# Altium schematic sheet ESP32C3_VOICE_LED_ES7243E_Sheet.SchDoc: ESP32C3_VOICE_LED
size A4; Author: Hoozz; Organization: Hoozz Play; DocumentNumber: 2; Revision: 1.0; SheetNumber: 2; SheetTotal: 3
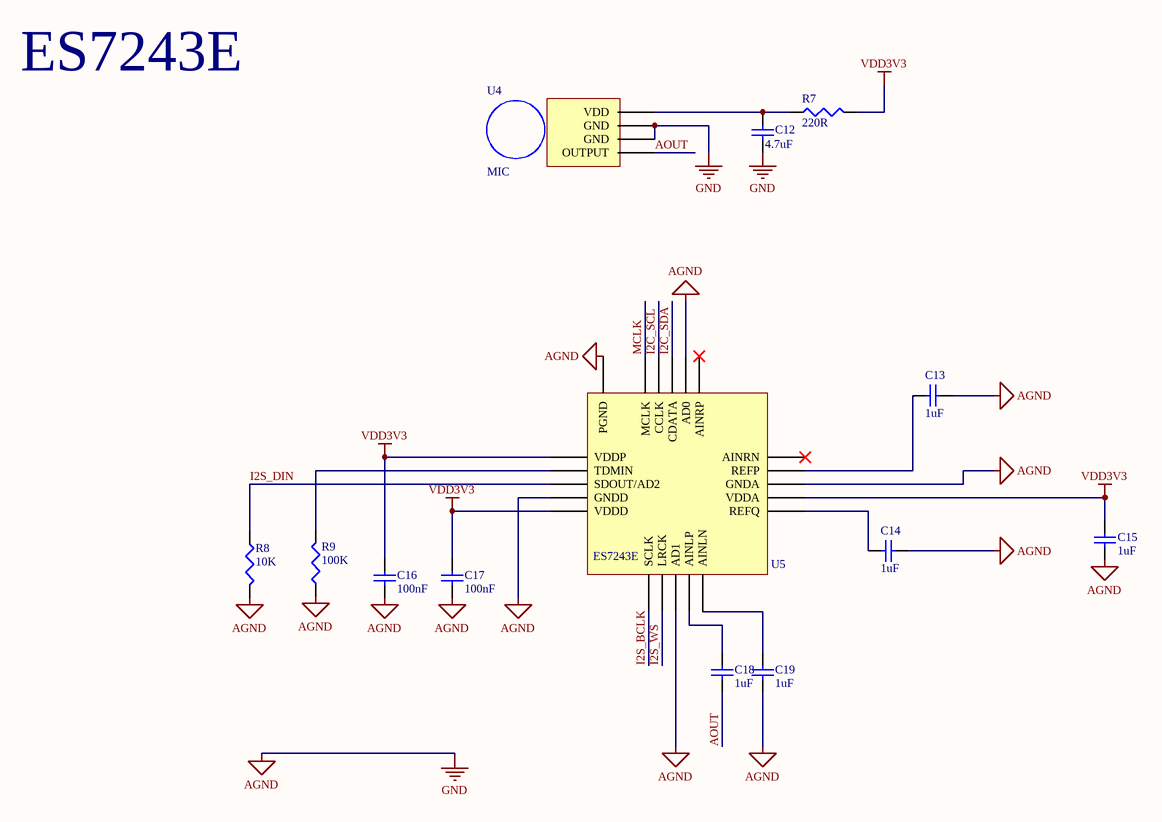
[diagram p0: ESP32C3_VOICE_LED_ES7243E_Sheet.SchDoc]

## Parts
C12  value 4.7uF  [0603]  (hidden comment: Cap)
C13  value 1uF  [0603]  (hidden comment: Cap)
C14  value 1uF  [0603]  (hidden comment: Cap)
C15  value 1uF  [0603]  (hidden comment: Cap)
C16  value 100nF  [0603]  (hidden comment: Cap)
C17  value 100nF  [0603]  (hidden comment: Cap)
C18  value 1uF  [0603]  (hidden comment: Cap)
C19  value 1uF  [0603]  (hidden comment: Cap)
R7  value 220R  [0603]  (hidden comment: Res)
R8  value 10K  [0603]  (hidden comment: Res)
R9  value 100K  [0603]  (hidden comment: Res)
U4  MIC  [MIC_XHXDZ_2718]
U5  ES7243E  [QFN20_3X3]

## Nets
AGND: C12.1 C13.2 C14.2 C15.2 C16.1 C17.1 C19.1 R8.2 R9.1 U4.2(GND) U4.3(GND) U5.4(GNDD) U5.8(AD1) U5.13(GNDA) U5.17(AD0) U5.21(PGND)  [also labelled GND]
VDD3V3: C15.1 C16.2 C17.2 R7.2 U5.1(VDDP) U5.5(VDDD) U5.12(VDDA)
AOUT: C18.1 U4.4(OUTPUT)
I2C_SCL: U5.19(CCLK)
I2C_SDA: U5.18(CDATA)
I2S_BCLK: U5.6(SCLK)
I2S_DIN: R8.1 U5.3(SDOUT/AD2)
I2S_WS: U5.7(LRCK)
MCLK: U5.20(MCLK)
NetC12_2: C12.2 R7.1 U4.1(VDD)
NetC13_1: C13.1 U5.14(REFP)
NetC14_1: C14.1 U5.11(REFQ)
NetC18_2: C18.2 U5.9(AINLP)
NetC19_2: C19.2 U5.10(AINLN)
NetR9_2: R9.2 U5.2(TDMIN)

Not connected (* = marked no-connect by the designer): U5 15(AINRN)* 16(AINRP)*

## Notes on the sheet
- ES7243E
- Title
- Size:
- Date:
- Author:
- A4
- Number:
- Time:
- Revision:
- Sheet
- of
- File:

## Library data of the parts
C12-C19 = Cap: Capacitor; Published: 8-Jun-2000; LatestRevisionDate: 17-Jul-2002; LatestRevisionNote: Re-released for DXP Platform.; PackageReference: RAD-0.3; Publisher: Altium Limited; PackageDescription: Radial Cap, Thru-Hole; 2 Leads; 0.3 in Pin Spacing
R7-R9 = Res: Resistor; Published: 8-Jun-2000; LatestRevisionDate: 29-May-2009; LatestRevisionNote: IPC-7351 Footprint Added.; PackageReference: J1-0603; Publisher: Altium Limited; PackageDescription: Chip Resistor
U4 = MIC_XHXDZ_2718